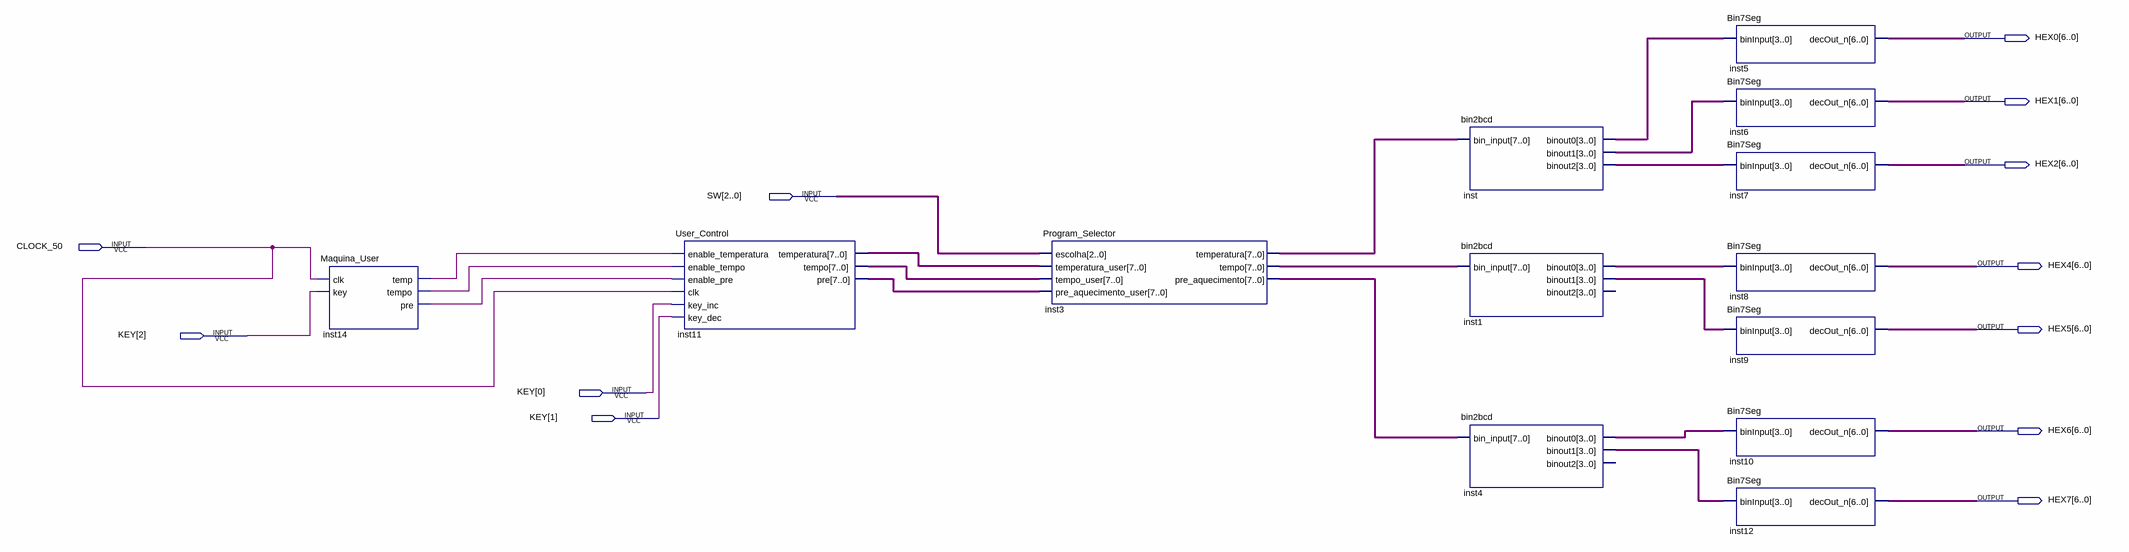
[diagram p0: schematic sheet]
// Quartus schematic tentativa1.bdf as structural Verilog: 13 symbols, 12 pins
module tentativa1 (
  input  [2:0] SW,
  input  CLOCK_50,
  input  [2:0] KEY,
  output [6:0] HEX0,
  output [6:0] HEX1,
  output [6:0] HEX2,
  output [6:0] HEX4,
  output [6:0] HEX5,
  output [6:0] HEX6,
  output [6:0] HEX7
);

  wire inst14_pre, inst14_temp, inst14_tempo;
  wire [3:0] inst1_binout0, inst1_binout1, inst4_binout0, inst4_binout1, inst_binout0, inst_binout1,
       inst_binout2;
  wire [7:0] inst3_pre_aquecimento, inst3_temperatura, inst3_tempo, inst11_pre, inst11_temperatura,
       inst11_tempo;

  Maquina_User inst14 (.clk(CLOCK_50), .key(KEY[2]), .temp(inst14_temp), .tempo(inst14_tempo), .pre(inst14_pre));
  User_Control inst11 (
    .enable_temperatura(inst14_temp), .enable_tempo(inst14_tempo), .enable_pre(inst14_pre), .clk(CLOCK_50),
    .key_inc(KEY[0]), .key_dec(KEY[1]), .temperatura(inst11_temperatura), .tempo(inst11_tempo),
    .pre(inst11_pre));
  Program_Selector inst3 (
    .escolha(SW), .temperatura_user(inst11_temperatura), .tempo_user(inst11_tempo),
    .pre_aquecimento_user(inst11_pre), .temperatura(inst3_temperatura), .tempo(inst3_tempo),
    .pre_aquecimento(inst3_pre_aquecimento));
  bin2bcd inst (.bin_input(inst3_temperatura), .binout0(inst_binout0), .binout1(inst_binout1), .binout2(inst_binout2));
  bin2bcd inst1 (.bin_input(inst3_tempo), .binout0(inst1_binout0), .binout1(inst1_binout1));  // open: binout2
  bin2bcd inst4 (.bin_input(inst3_pre_aquecimento), .binout0(inst4_binout0), .binout1(inst4_binout1));  // open: binout2
  Bin7Seg inst5 (.binInput(inst_binout0), .decOut_n(HEX0));
  Bin7Seg inst6 (.binInput(inst_binout1), .decOut_n(HEX1));
  Bin7Seg inst7 (.binInput(inst_binout2), .decOut_n(HEX2));
  Bin7Seg inst8 (.binInput(inst1_binout0), .decOut_n(HEX4));
  Bin7Seg inst9 (.binInput(inst1_binout1), .decOut_n(HEX5));
  Bin7Seg inst10 (.binInput(inst4_binout0), .decOut_n(HEX6));
  Bin7Seg inst12 (.binInput(inst4_binout1), .decOut_n(HEX7));
endmodule
